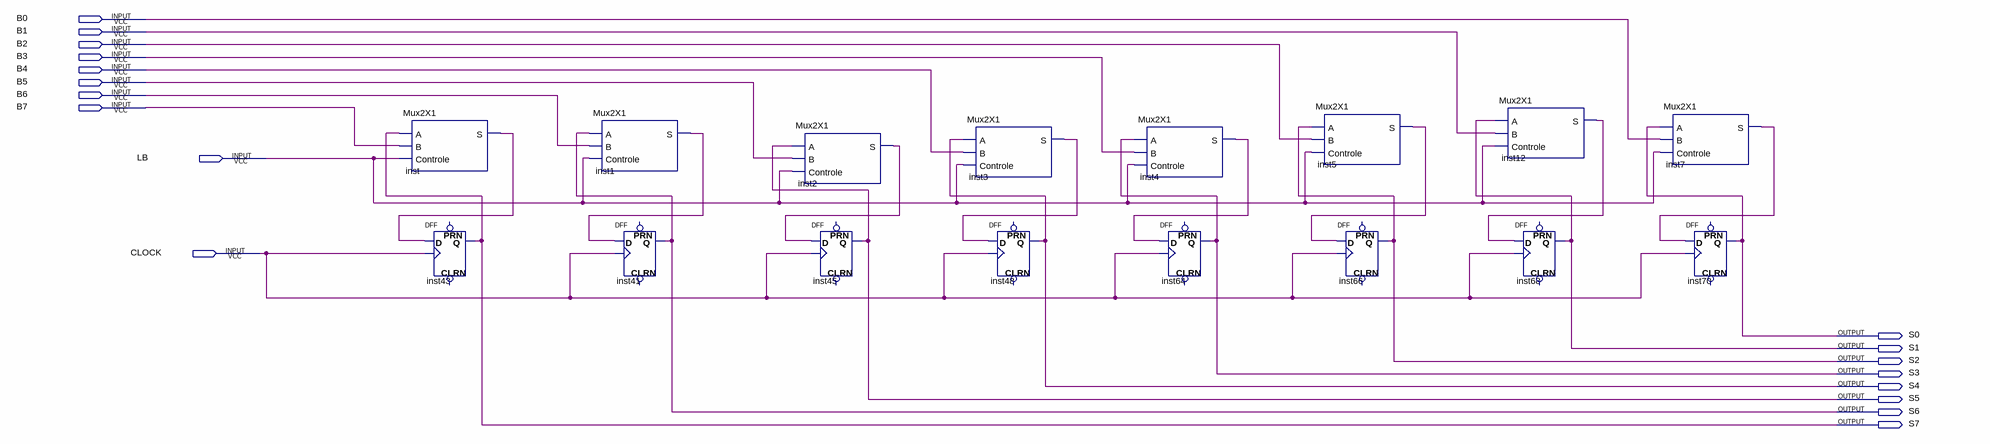
[diagram p0: schematic sheet]
// Quartus schematic Registrador8Bit.bdf as structural Verilog: 16 symbols, 18 pins
module Registrador8Bit (
  input  B0,
  input  B1,
  input  B2,
  input  B3,
  input  B4,
  input  B5,
  input  B6,
  input  B7,
  input  LB,
  input  CLOCK,
  output S0,
  output S1,
  output S2,
  output S3,
  output S4,
  output S5,
  output S6,
  output S7
);

  wire inst1_s, inst2_s, inst3_s, inst4_s, inst5_s, inst7_s, inst12_s, inst_s;

  Mux2X1 inst (.A(S7), .B(B7), .Controle(LB), .S(inst_s));
  DFF inst43 (.CLK(CLOCK), .D(inst_s), .Q(S7));  // open: CLRN, PRN
  Mux2X1 inst1 (.A(S6), .B(B6), .Controle(LB), .S(inst1_s));
  DFF inst41 (.CLK(CLOCK), .D(inst1_s), .Q(S6));  // open: CLRN, PRN
  Mux2X1 inst2 (.A(S5), .B(B5), .Controle(LB), .S(inst2_s));
  DFF inst45 (.CLK(CLOCK), .D(inst2_s), .Q(S5));  // open: CLRN, PRN
  Mux2X1 inst3 (.A(S4), .B(B4), .Controle(LB), .S(inst3_s));
  DFF inst48 (.CLK(CLOCK), .D(inst3_s), .Q(S4));  // open: CLRN, PRN
  Mux2X1 inst4 (.A(S3), .B(B3), .Controle(LB), .S(inst4_s));
  DFF inst64 (.CLK(CLOCK), .D(inst4_s), .Q(S3));  // open: CLRN, PRN
  Mux2X1 inst5 (.A(S2), .B(B2), .Controle(LB), .S(inst5_s));
  DFF inst66 (.CLK(CLOCK), .D(inst5_s), .Q(S2));  // open: CLRN, PRN
  Mux2X1 inst12 (.A(S1), .B(B1), .Controle(LB), .S(inst12_s));
  DFF inst68 (.CLK(CLOCK), .D(inst12_s), .Q(S1));  // open: CLRN, PRN
  Mux2X1 inst7 (.A(S0), .B(B0), .Controle(LB), .S(inst7_s));
  DFF inst70 (.CLK(CLOCK), .D(inst7_s), .Q(S0));  // open: CLRN, PRN
endmodule
